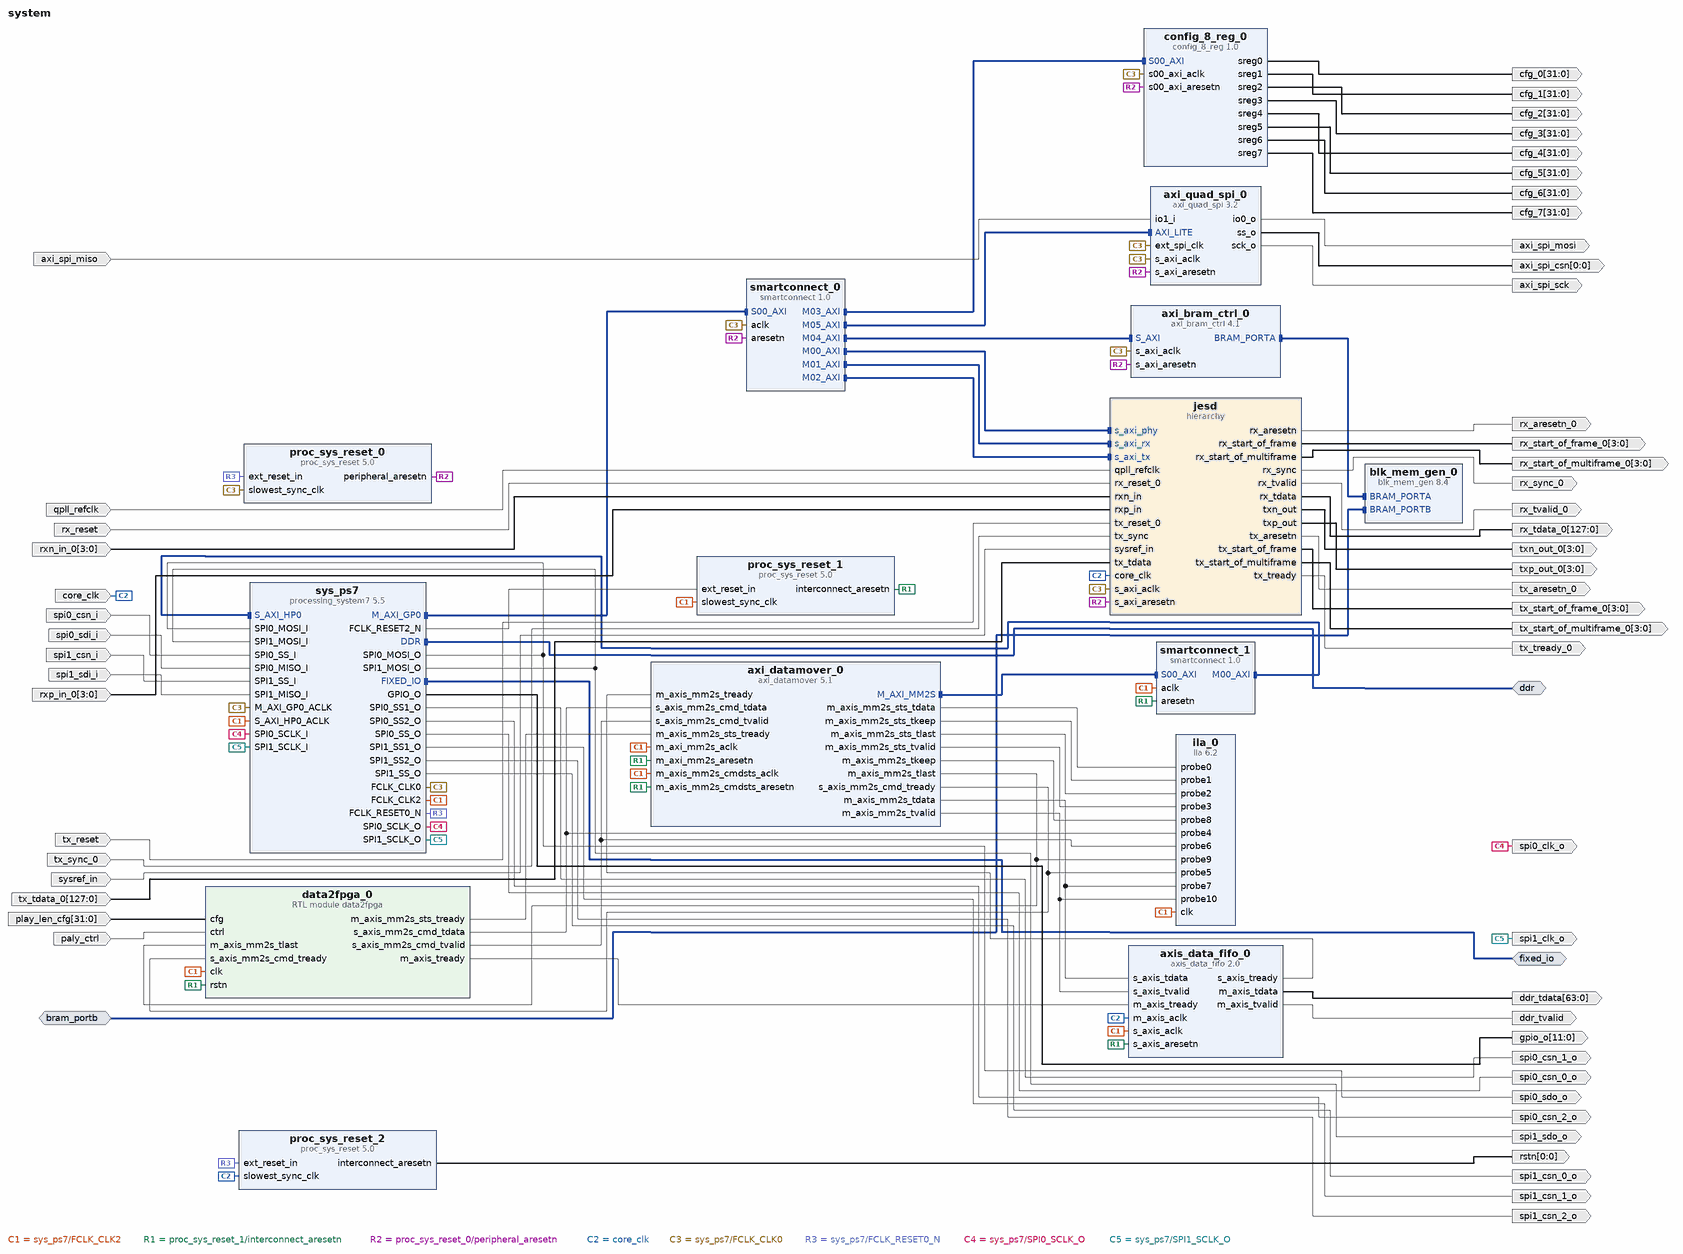
[diagram p0: block diagram of the top level]
# Vivado block design system, xc7z045ffg900-2, Vivado 2022.2
create_bd_design system

create_bd_intf_port -mode Master -vlnv xilinx.com:interface:ddrx_rtl:1.0 ddr
create_bd_intf_port -mode Master -vlnv xilinx.com:display_processing_system7:fixedio_rtl:1.0 fixed_io
create_bd_intf_port -mode Slave -vlnv xilinx.com:interface:bram_rtl:1.0 bram_portb
set_property -dict {CONFIG.MASTER_TYPE BRAM_CTRL CONFIG.READ_WRITE_MODE READ_WRITE} [get_bd_intf_ports bram_portb]
create_bd_port -dir O spi0_clk_o
create_bd_port -dir O spi0_csn_0_o
create_bd_port -dir O spi0_csn_1_o
create_bd_port -dir O spi0_csn_2_o
create_bd_port -dir I spi0_csn_i
create_bd_port -dir I spi0_sdi_i
create_bd_port -dir O spi0_sdo_o
create_bd_port -dir O spi1_clk_o
create_bd_port -dir O spi1_csn_0_o
create_bd_port -dir O spi1_csn_1_o
create_bd_port -dir O spi1_csn_2_o
create_bd_port -dir I spi1_csn_i
create_bd_port -dir I spi1_sdi_i
create_bd_port -dir O spi1_sdo_o
create_bd_port -dir O -from 3 -to 0 txp_out_0
create_bd_port -dir O -from 3 -to 0 txn_out_0
create_bd_port -dir O rx_sync_0
create_bd_port -dir O -type rst tx_aresetn_0
create_bd_port -dir O -type rst rx_aresetn_0
create_bd_port -dir O rx_tvalid_0
create_bd_port -dir O tx_tready_0
create_bd_port -dir O -from 3 -to 0 rx_start_of_frame_0
create_bd_port -dir O -from 3 -to 0 rx_start_of_multiframe_0
create_bd_port -dir O -from 3 -to 0 tx_start_of_frame_0
create_bd_port -dir O -from 3 -to 0 tx_start_of_multiframe_0
create_bd_port -dir I tx_sync_0
create_bd_port -dir I sysref_in
create_bd_port -dir I -type clk core_clk
set_property -dict {CONFIG.ASSOCIATED_RESET rstn CONFIG.FREQ_HZ 250000000} [get_bd_ports core_clk]
create_bd_port -dir I -type clk qpll_refclk
set_property -dict {CONFIG.FREQ_HZ 250000000} [get_bd_ports qpll_refclk]
create_bd_port -dir I rx_reset
create_bd_port -dir I tx_reset
create_bd_port -dir O -from 127 -to 0 rx_tdata_0
create_bd_port -dir I -from 127 -to 0 tx_tdata_0
create_bd_port -dir I -from 3 -to 0 rxp_in_0
create_bd_port -dir I -from 3 -to 0 rxn_in_0
create_bd_port -dir O -from 11 -to 0 gpio_o
create_bd_port -dir O -from 31 -to 0 cfg_0
create_bd_port -dir O -from 31 -to 0 cfg_1
create_bd_port -dir O -from 31 -to 0 cfg_2
create_bd_port -dir O -from 31 -to 0 cfg_3
create_bd_port -dir O -from 63 -to 0 ddr_tdata
create_bd_port -dir O ddr_tvalid
create_bd_port -dir O -from 31 -to 0 cfg_4
create_bd_port -dir O -from 31 -to 0 cfg_5
create_bd_port -dir O -from 31 -to 0 cfg_6
create_bd_port -dir O -from 31 -to 0 cfg_7
create_bd_port -dir I paly_ctrl
create_bd_port -dir I -from 31 -to 0 play_len_cfg
create_bd_port -dir O -from 0 -to 0 -type rst rstn
create_bd_port -dir O axi_spi_sck
create_bd_port -dir O -from 0 -to 0 axi_spi_csn
create_bd_port -dir O axi_spi_mosi
create_bd_port -dir I axi_spi_miso

create_bd_cell -type ip -vlnv xilinx.com:ip:processing_system7:5.5 sys_ps7
set_property -dict [list \
  CONFIG.PCW_APU_PERIPHERAL_FREQMHZ 667.000000 \
  CONFIG.PCW_DUAL_PARALLEL_QSPI_DATA_MODE x8 \
  CONFIG.PCW_ENET0_ENET0_IO {MIO 16 .. 27} \
  CONFIG.PCW_ENET0_GRP_MDIO_ENABLE 1 \
  CONFIG.PCW_ENET0_GRP_MDIO_IO {MIO 52 .. 53} \
  CONFIG.PCW_ENET0_PERIPHERAL_ENABLE 1 \
  CONFIG.PCW_ENET0_RESET_ENABLE 0 \
  CONFIG.PCW_ENET_RESET_ENABLE 1 \
  CONFIG.PCW_ENET_RESET_SELECT {Share reset pin} \
  CONFIG.PCW_EN_CLK2_PORT 1 \
  CONFIG.PCW_EN_RST2_PORT 1 \
  CONFIG.PCW_FCLK2_PERIPHERAL_CLKSRC {DDR PLL} \
  CONFIG.PCW_FCLK_CLK2_BUF TRUE \
  CONFIG.PCW_FPGA0_PERIPHERAL_FREQMHZ 100.0 \
  CONFIG.PCW_FPGA1_PERIPHERAL_FREQMHZ 200.0 \
  CONFIG.PCW_FPGA2_PERIPHERAL_FREQMHZ 250 \
  CONFIG.PCW_FPGA_FCLK2_ENABLE 1 \
  CONFIG.PCW_GPIO_EMIO_GPIO_ENABLE 1 \
  CONFIG.PCW_GPIO_EMIO_GPIO_IO 12 \
  CONFIG.PCW_GPIO_EMIO_GPIO_WIDTH 12 \
  CONFIG.PCW_GPIO_MIO_GPIO_ENABLE 1 \
  CONFIG.PCW_GPIO_MIO_GPIO_IO MIO \
  CONFIG.PCW_I2C_RESET_ENABLE 0 \
  CONFIG.PCW_IRQ_F2P_MODE REVERSE \
  CONFIG.PCW_PRESET_BANK0_VOLTAGE {LVCMOS 1.8V} \
  CONFIG.PCW_PRESET_BANK1_VOLTAGE {LVCMOS 1.8V} \
  CONFIG.PCW_QSPI_GRP_FBCLK_ENABLE 1 \
  CONFIG.PCW_QSPI_GRP_FBCLK_IO {MIO 8} \
  CONFIG.PCW_QSPI_GRP_IO1_ENABLE 1 \
  CONFIG.PCW_QSPI_GRP_IO1_IO {MIO 0 9 .. 13} \
  CONFIG.PCW_QSPI_GRP_SINGLE_SS_ENABLE 0 \
  CONFIG.PCW_QSPI_INTERNAL_HIGHADDRESS 0xFDFFFFFF \
  CONFIG.PCW_QSPI_PERIPHERAL_ENABLE 1 \
  CONFIG.PCW_QSPI_QSPI_IO {MIO 1 .. 6} \
  CONFIG.PCW_SD0_GRP_CD_ENABLE 1 \
  CONFIG.PCW_SD0_GRP_CD_IO {MIO 14} \
  CONFIG.PCW_SD0_GRP_WP_ENABLE 1 \
  CONFIG.PCW_SD0_GRP_WP_IO {MIO 15} \
  CONFIG.PCW_SD0_PERIPHERAL_ENABLE 1 \
  CONFIG.PCW_SD0_SD0_IO {MIO 40 .. 45} \
  CONFIG.PCW_SDIO_PERIPHERAL_FREQMHZ 100 \
  CONFIG.PCW_SPI0_PERIPHERAL_ENABLE 1 \
  CONFIG.PCW_SPI0_SPI0_IO EMIO \
  CONFIG.PCW_SPI1_PERIPHERAL_ENABLE 1 \
  CONFIG.PCW_SPI1_SPI1_IO EMIO \
  CONFIG.PCW_UART1_PERIPHERAL_ENABLE 1 \
  CONFIG.PCW_UART1_UART1_IO {MIO 48 .. 49} \
  CONFIG.PCW_UART_PERIPHERAL_FREQMHZ 50 \
  CONFIG.PCW_UIPARAM_DDR_FREQ_MHZ 533.333313 \
  CONFIG.PCW_UIPARAM_DDR_PARTNO Custom \
  CONFIG.PCW_USB0_PERIPHERAL_ENABLE 0 \
  CONFIG.PCW_USB_RESET_ENABLE 0 \
  CONFIG.PCW_USE_S_AXI_HP0 1 \
  CONFIG.preset ZC706 \
] [get_bd_cells sys_ps7]
# 260 more settings of sys_ps7 are not shown: defaults, MIO pin electricals, DDR timing, and values the tool derives
create_bd_cell -type hier jesd
create_bd_cell -type ip -vlnv xilinx.com:ip:proc_sys_reset:5.0 proc_sys_reset_0
create_bd_cell -type ip -vlnv xilinx.com:ip:proc_sys_reset:5.0 proc_sys_reset_1
create_bd_cell -type ip -vlnv xilinx.com:ip:proc_sys_reset:5.0 proc_sys_reset_2
create_bd_cell -type module -reference data2fpga data2fpga_0
create_bd_cell -type ip -vlnv xilinx.com:user:config_8_reg:1.0 config_8_reg_0
create_bd_cell -type ip -vlnv xilinx.com:ip:axi_bram_ctrl:4.1 axi_bram_ctrl_0
set_property -dict {CONFIG.DATA_WIDTH 128 CONFIG.SINGLE_PORT_BRAM 1} [get_bd_cells axi_bram_ctrl_0]
create_bd_cell -type ip -vlnv xilinx.com:ip:axi_datamover:5.1 axi_datamover_0
set_property -dict [list \
  CONFIG.c_dummy 1 \
  CONFIG.c_enable_cache_user false \
  CONFIG.c_enable_mm2s_adv_sig 0 \
  CONFIG.c_enable_s2mm 0 \
  CONFIG.c_m_axi_mm2s_data_width 128 \
  CONFIG.c_m_axis_mm2s_tdata_width 64 \
  CONFIG.c_mm2s_btt_used 23 \
  CONFIG.c_mm2s_burst_size 16 \
] [get_bd_cells axi_datamover_0]
create_bd_cell -type ip -vlnv xilinx.com:ip:axi_quad_spi:3.2 axi_quad_spi_0
set_property -dict {CONFIG.C_SCK_RATIO 8 CONFIG.C_USE_STARTUP 0} [get_bd_cells axi_quad_spi_0]
create_bd_cell -type ip -vlnv xilinx.com:ip:axis_data_fifo:2.0 axis_data_fifo_0
set_property -dict {CONFIG.IS_ACLK_ASYNC 1 CONFIG.TDATA_NUM_BYTES 8} [get_bd_cells axis_data_fifo_0]
create_bd_cell -type ip -vlnv xilinx.com:ip:blk_mem_gen:8.4 blk_mem_gen_0
set_property -dict [list \
  CONFIG.EN_SAFETY_CKT false \
  CONFIG.Enable_32bit_Address true \
  CONFIG.Enable_B Use_ENB_Pin \
  CONFIG.Memory_Type True_Dual_Port_RAM \
  CONFIG.Port_B_Clock 100 \
  CONFIG.Port_B_Enable_Rate 100 \
  CONFIG.Port_B_Write_Rate 50 \
  CONFIG.Read_Width_A 128 \
  CONFIG.Read_Width_B 128 \
  CONFIG.Register_PortA_Output_of_Memory_Primitives false \
  CONFIG.Register_PortB_Output_of_Memory_Primitives false \
  CONFIG.Use_RSTA_Pin true \
  CONFIG.Use_RSTB_Pin true \
  CONFIG.Write_Width_A 128 \
  CONFIG.Write_Width_B 128 \
  CONFIG.use_bram_block BRAM_Controller \
] [get_bd_cells blk_mem_gen_0]
create_bd_cell -type ip -vlnv xilinx.com:ip:ila:6.2 ila_0
set_property -dict [list \
  CONFIG.C_DATA_DEPTH 8192 \
  CONFIG.C_ENABLE_ILA_AXI_MON false \
  CONFIG.C_MONITOR_TYPE Native \
  CONFIG.C_NUM_OF_PROBES 11 \
  CONFIG.C_PROBE0_WIDTH 8 \
  CONFIG.C_PROBE4_WIDTH 72 \
  CONFIG.C_PROBE7_WIDTH 64 \
] [get_bd_cells ila_0]
create_bd_cell -type ip -vlnv xilinx.com:ip:smartconnect:1.0 smartconnect_0
set_property -dict {CONFIG.NUM_MI 6 CONFIG.NUM_SI 1} [get_bd_cells smartconnect_0]
create_bd_cell -type ip -vlnv xilinx.com:ip:smartconnect:1.0 smartconnect_1
set_property -dict {CONFIG.NUM_SI 1} [get_bd_cells smartconnect_1]

# ---- hierarchy /jesd ----
current_bd_instance /jesd
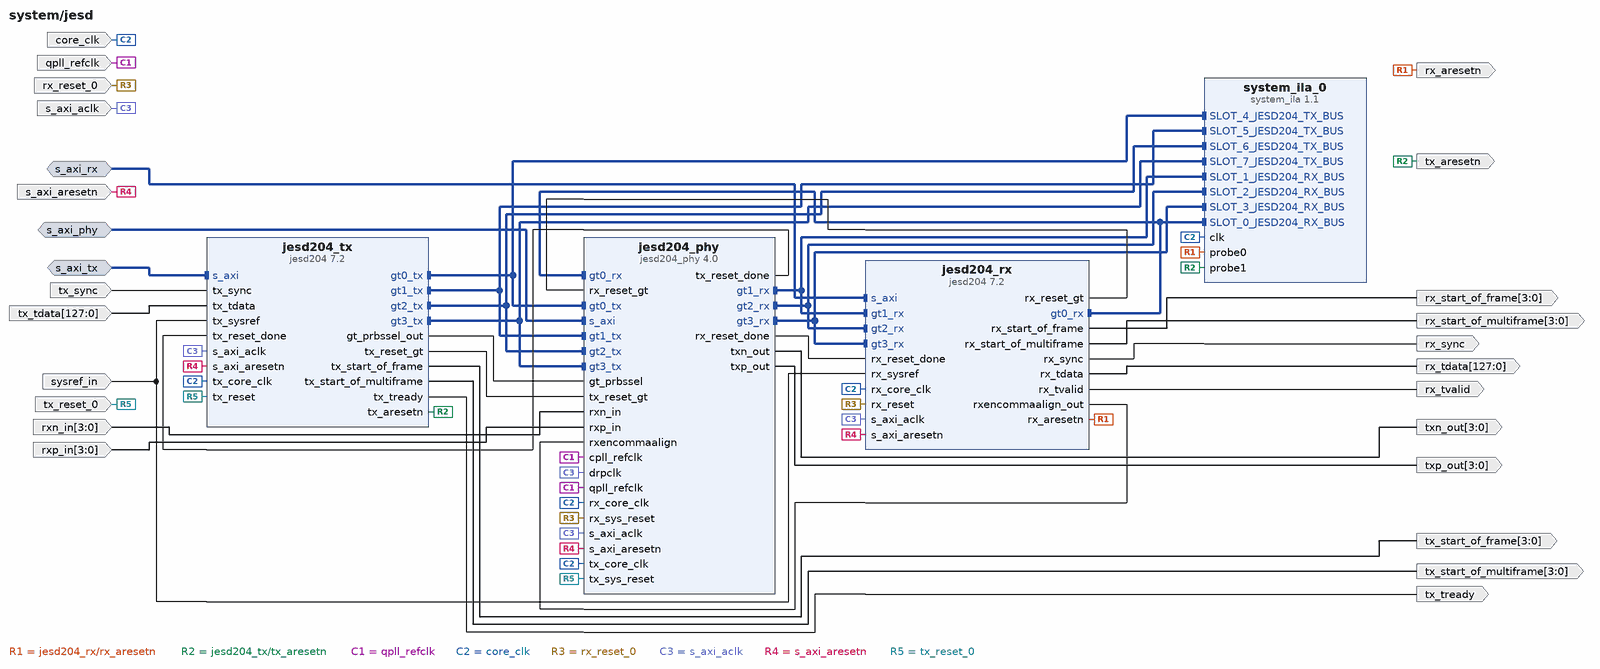
[diagram p1: block diagram inside /jesd]
create_bd_intf_pin -mode Slave -vlnv xilinx.com:interface:aximm_rtl:1.0 s_axi_phy
create_bd_intf_pin -mode Slave -vlnv xilinx.com:interface:aximm_rtl:1.0 s_axi_rx
create_bd_intf_pin -mode Slave -vlnv xilinx.com:interface:aximm_rtl:1.0 s_axi_tx
create_bd_pin -dir I -type clk qpll_refclk
create_bd_pin -dir I -type clk s_axi_aclk
create_bd_pin -dir I tx_reset_0
create_bd_pin -dir O -from 3 -to 0 txp_out
create_bd_pin -dir O -from 3 -to 0 txn_out
create_bd_pin -dir I -type clk core_clk
create_bd_pin -dir I -type rst s_axi_aresetn
create_bd_pin -dir O -type rst rx_aresetn
create_bd_pin -dir O rx_tvalid
create_bd_pin -dir O -from 3 -to 0 rx_start_of_frame
create_bd_pin -dir O -from 3 -to 0 rx_start_of_multiframe
create_bd_pin -dir I sysref_in
create_bd_pin -dir O rx_sync
create_bd_pin -dir O -from 3 -to 0 tx_start_of_frame
create_bd_pin -dir O -from 3 -to 0 tx_start_of_multiframe
create_bd_pin -dir O -type rst tx_aresetn
create_bd_pin -dir O tx_tready
create_bd_pin -dir I tx_sync
create_bd_pin -dir I rx_reset_0
create_bd_pin -dir O -from 127 -to 0 rx_tdata
create_bd_pin -dir I -from 127 -to 0 tx_tdata
create_bd_pin -dir I -from 3 -to 0 rxp_in
create_bd_pin -dir I -from 3 -to 0 rxn_in

create_bd_cell -type ip -vlnv xilinx.com:ip:jesd204:7.2 jesd204_rx
set_property -dict [list \
  CONFIG.C_DEFAULT_F 4 \
  CONFIG.C_DEFAULT_SCR 1 \
  CONFIG.C_LANES 4 \
  CONFIG.C_NODE_IS_TRANSMIT 0 \
] [get_bd_cells jesd204_rx]
create_bd_cell -type ip -vlnv xilinx.com:ip:jesd204:7.2 jesd204_tx
set_property -dict {CONFIG.C_DEFAULT_F 4 CONFIG.C_DEFAULT_SCR 1 CONFIG.C_LANES 4} [get_bd_cells jesd204_tx]
create_bd_cell -type ip -vlnv xilinx.com:ip:jesd204_phy:4.0 jesd204_phy
set_property -dict [list \
  CONFIG.C_LANES 4 \
  CONFIG.C_PLL_SELECTION 3 \
  CONFIG.Config_Type 1 \
  CONFIG.GT_Line_Rate 9.8304 \
  CONFIG.GT_REFCLK_FREQ 245.760 \
  CONFIG.Max_Line_Rate 10 \
  CONFIG.Min_Line_Rate 6 \
  CONFIG.RX_GT_Line_Rate 9.8304 \
  CONFIG.RX_GT_REFCLK_FREQ 245.760 \
  CONFIG.RX_PLL_SELECTION 3 \
] [get_bd_cells jesd204_phy]
create_bd_cell -type ip -vlnv xilinx.com:ip:system_ila:1.1 system_ila_0
set_property -dict [list \
  CONFIG.C_MON_TYPE MIX \
  CONFIG.C_NUM_MONITOR_SLOTS 8 \
  CONFIG.C_NUM_OF_PROBES 2 \
  CONFIG.C_SLOT 7 \
  CONFIG.C_SLOT_0_INTF_TYPE xilinx.com:display_jesd204:jesd204_rx_bus_rtl:1.0 \
  CONFIG.C_SLOT_1_INTF_TYPE xilinx.com:display_jesd204:jesd204_rx_bus_rtl:1.0 \
  CONFIG.C_SLOT_2_INTF_TYPE xilinx.com:display_jesd204:jesd204_rx_bus_rtl:1.0 \
  CONFIG.C_SLOT_3_INTF_TYPE xilinx.com:display_jesd204:jesd204_rx_bus_rtl:1.0 \
  CONFIG.C_SLOT_4_INTF_TYPE xilinx.com:display_jesd204:jesd204_tx_bus_rtl:1.0 \
  CONFIG.C_SLOT_5_INTF_TYPE xilinx.com:display_jesd204:jesd204_tx_bus_rtl:1.0 \
  CONFIG.C_SLOT_6_INTF_TYPE xilinx.com:display_jesd204:jesd204_tx_bus_rtl:1.0 \
  CONFIG.C_SLOT_7_INTF_TYPE xilinx.com:display_jesd204:jesd204_tx_bus_rtl:1.0 \
] [get_bd_cells system_ila_0]

# ---- connections ----

current_bd_instance /jesd
connect_bd_intf_net [get_bd_intf_pins jesd204_rx/gt0_rx] [get_bd_intf_pins jesd204_phy/gt0_rx]
connect_bd_intf_net [get_bd_intf_pins jesd204_rx/gt0_rx] [get_bd_intf_pins system_ila_0/SLOT_0_JESD204_RX_BUS]
connect_bd_intf_net [get_bd_intf_pins jesd204_phy/gt1_rx] [get_bd_intf_pins jesd204_rx/gt1_rx]
connect_bd_intf_net [get_bd_intf_pins jesd204_phy/gt1_rx] [get_bd_intf_pins system_ila_0/SLOT_1_JESD204_RX_BUS]
connect_bd_intf_net [get_bd_intf_pins jesd204_phy/gt2_rx] [get_bd_intf_pins jesd204_rx/gt2_rx]
connect_bd_intf_net [get_bd_intf_pins jesd204_phy/gt2_rx] [get_bd_intf_pins system_ila_0/SLOT_2_JESD204_RX_BUS]
connect_bd_intf_net [get_bd_intf_pins jesd204_phy/gt3_rx] [get_bd_intf_pins jesd204_rx/gt3_rx]
connect_bd_intf_net [get_bd_intf_pins jesd204_phy/gt3_rx] [get_bd_intf_pins system_ila_0/SLOT_3_JESD204_RX_BUS]
connect_bd_intf_net [get_bd_intf_pins jesd204_tx/gt0_tx] [get_bd_intf_pins jesd204_phy/gt0_tx]
connect_bd_intf_net [get_bd_intf_pins jesd204_tx/gt0_tx] [get_bd_intf_pins system_ila_0/SLOT_4_JESD204_TX_BUS]
connect_bd_intf_net [get_bd_intf_pins jesd204_tx/gt1_tx] [get_bd_intf_pins jesd204_phy/gt1_tx]
connect_bd_intf_net [get_bd_intf_pins jesd204_tx/gt1_tx] [get_bd_intf_pins system_ila_0/SLOT_5_JESD204_TX_BUS]
connect_bd_intf_net [get_bd_intf_pins jesd204_tx/gt2_tx] [get_bd_intf_pins jesd204_phy/gt2_tx]
connect_bd_intf_net [get_bd_intf_pins jesd204_tx/gt2_tx] [get_bd_intf_pins system_ila_0/SLOT_6_JESD204_TX_BUS]
connect_bd_intf_net [get_bd_intf_pins jesd204_tx/gt3_tx] [get_bd_intf_pins jesd204_phy/gt3_tx]
connect_bd_intf_net [get_bd_intf_pins jesd204_tx/gt3_tx] [get_bd_intf_pins system_ila_0/SLOT_7_JESD204_TX_BUS]
connect_bd_intf_net -intf_net s_axi_0_1 [get_bd_intf_pins s_axi_phy] [get_bd_intf_pins jesd204_phy/s_axi]
connect_bd_intf_net -intf_net s_axi_0_2 [get_bd_intf_pins s_axi_tx] [get_bd_intf_pins jesd204_tx/s_axi]
connect_bd_intf_net -intf_net s_axi_0_3 [get_bd_intf_pins s_axi_rx] [get_bd_intf_pins jesd204_rx/s_axi]
connect_bd_net [get_bd_pins jesd204_phy/rx_reset_done] [get_bd_pins jesd204_rx/rx_reset_done]
connect_bd_net [get_bd_pins jesd204_phy/tx_reset_done] [get_bd_pins jesd204_tx/tx_reset_done]
connect_bd_net [get_bd_pins jesd204_phy/txn_out] [get_bd_pins txn_out]
connect_bd_net [get_bd_pins jesd204_phy/txp_out] [get_bd_pins txp_out]
connect_bd_net [get_bd_pins jesd204_rx/rx_aresetn] [get_bd_pins rx_aresetn] [get_bd_pins system_ila_0/probe0]
connect_bd_net [get_bd_pins jesd204_rx/rx_reset_gt] [get_bd_pins jesd204_phy/rx_reset_gt]
connect_bd_net [get_bd_pins jesd204_rx/rx_start_of_frame] [get_bd_pins rx_start_of_frame]
connect_bd_net [get_bd_pins jesd204_rx/rx_start_of_multiframe] [get_bd_pins rx_start_of_multiframe]
connect_bd_net [get_bd_pins jesd204_rx/rx_sync] [get_bd_pins rx_sync]
connect_bd_net [get_bd_pins jesd204_rx/rx_tdata] [get_bd_pins rx_tdata]
connect_bd_net [get_bd_pins jesd204_rx/rx_tvalid] [get_bd_pins rx_tvalid]
connect_bd_net [get_bd_pins jesd204_rx/rxencommaalign_out] [get_bd_pins jesd204_phy/rxencommaalign]
connect_bd_net [get_bd_pins jesd204_tx/gt_prbssel_out] [get_bd_pins jesd204_phy/gt_prbssel]
connect_bd_net [get_bd_pins jesd204_tx/tx_aresetn] [get_bd_pins tx_aresetn] [get_bd_pins system_ila_0/probe1]
connect_bd_net [get_bd_pins jesd204_tx/tx_reset_gt] [get_bd_pins jesd204_phy/tx_reset_gt]
connect_bd_net [get_bd_pins jesd204_tx/tx_start_of_frame] [get_bd_pins tx_start_of_frame]
connect_bd_net [get_bd_pins jesd204_tx/tx_start_of_multiframe] [get_bd_pins tx_start_of_multiframe]
connect_bd_net [get_bd_pins jesd204_tx/tx_tready] [get_bd_pins tx_tready]
connect_bd_net -net qpll_refclk_0_1 [get_bd_pins qpll_refclk] [get_bd_pins jesd204_phy/cpll_refclk] [get_bd_pins jesd204_phy/qpll_refclk]
connect_bd_net -net rx_core_clk_0_1 [get_bd_pins core_clk] \
  [get_bd_pins jesd204_rx/rx_core_clk] [get_bd_pins jesd204_tx/tx_core_clk] [get_bd_pins jesd204_phy/tx_core_clk] \
  [get_bd_pins jesd204_phy/rx_core_clk] [get_bd_pins system_ila_0/clk]
connect_bd_net [get_bd_pins rx_reset_0] [get_bd_pins jesd204_rx/rx_reset] [get_bd_pins jesd204_phy/rx_sys_reset]
connect_bd_net -net rxn_in_0_1 [get_bd_pins rxn_in] [get_bd_pins jesd204_phy/rxn_in]
connect_bd_net -net rxp_in_0_1 [get_bd_pins rxp_in] [get_bd_pins jesd204_phy/rxp_in]
connect_bd_net -net s_axi_aclk_0_1 [get_bd_pins s_axi_aclk] \
  [get_bd_pins jesd204_rx/s_axi_aclk] [get_bd_pins jesd204_tx/s_axi_aclk] [get_bd_pins jesd204_phy/drpclk] \
  [get_bd_pins jesd204_phy/s_axi_aclk]
connect_bd_net -net s_axi_aresetn_0_1 [get_bd_pins s_axi_aresetn] \
  [get_bd_pins jesd204_rx/s_axi_aresetn] [get_bd_pins jesd204_tx/s_axi_aresetn] [get_bd_pins jesd204_phy/s_axi_aresetn]
connect_bd_net -net tx_reset_0_1 [get_bd_pins tx_reset_0] [get_bd_pins jesd204_tx/tx_reset] [get_bd_pins jesd204_phy/tx_sys_reset]
connect_bd_net -net tx_sync_0_1 [get_bd_pins tx_sync] [get_bd_pins jesd204_tx/tx_sync]
connect_bd_net -net tx_sysref_0_1 [get_bd_pins sysref_in] [get_bd_pins jesd204_rx/rx_sysref] [get_bd_pins jesd204_tx/tx_sysref]
connect_bd_net -net tx_tdata_1_1 [get_bd_pins tx_tdata] [get_bd_pins jesd204_tx/tx_tdata]

current_bd_instance /
connect_bd_intf_net -intf_net BRAM_PORTB_0_1 [get_bd_intf_ports bram_portb] [get_bd_intf_pins blk_mem_gen_0/BRAM_PORTB]
connect_bd_intf_net [get_bd_intf_pins blk_mem_gen_0/BRAM_PORTA] [get_bd_intf_pins axi_bram_ctrl_0/BRAM_PORTA]
connect_bd_intf_net [get_bd_intf_pins smartconnect_1/S00_AXI] [get_bd_intf_pins axi_datamover_0/M_AXI_MM2S]
connect_bd_intf_net [get_bd_intf_pins smartconnect_0/M00_AXI] [get_bd_intf_pins jesd/s_axi_phy]
connect_bd_intf_net [get_bd_intf_pins smartconnect_0/M01_AXI] [get_bd_intf_pins jesd/s_axi_rx]
connect_bd_intf_net [get_bd_intf_pins smartconnect_0/M02_AXI] [get_bd_intf_pins jesd/s_axi_tx]
connect_bd_intf_net [get_bd_intf_pins config_8_reg_0/S00_AXI] [get_bd_intf_pins smartconnect_0/M03_AXI]
connect_bd_intf_net [get_bd_intf_pins axi_bram_ctrl_0/S_AXI] [get_bd_intf_pins smartconnect_0/M04_AXI]
connect_bd_intf_net [get_bd_intf_pins smartconnect_0/M05_AXI] [get_bd_intf_pins axi_quad_spi_0/AXI_LITE]
connect_bd_intf_net [get_bd_intf_pins smartconnect_1/M00_AXI] [get_bd_intf_pins sys_ps7/S_AXI_HP0]
connect_bd_intf_net [get_bd_intf_ports ddr] [get_bd_intf_pins sys_ps7/DDR]
connect_bd_intf_net [get_bd_intf_ports fixed_io] [get_bd_intf_pins sys_ps7/FIXED_IO]
connect_bd_intf_net [get_bd_intf_pins sys_ps7/M_AXI_GP0] [get_bd_intf_pins smartconnect_0/S00_AXI]
connect_bd_net [get_bd_pins sys_ps7/FCLK_CLK2] \
  [get_bd_pins sys_ps7/S_AXI_HP0_ACLK] [get_bd_pins proc_sys_reset_1/slowest_sync_clk] [get_bd_pins data2fpga_0/clk] \
  [get_bd_pins axi_datamover_0/m_axi_mm2s_aclk] [get_bd_pins axi_datamover_0/m_axis_mm2s_cmdsts_aclk] \
  [get_bd_pins axis_data_fifo_0/s_axis_aclk] [get_bd_pins ila_0/clk] [get_bd_pins smartconnect_1/aclk]
connect_bd_net [get_bd_pins proc_sys_reset_1/interconnect_aresetn] \
  [get_bd_pins data2fpga_0/rstn] [get_bd_pins axi_datamover_0/m_axi_mm2s_aresetn] \
  [get_bd_pins axi_datamover_0/m_axis_mm2s_cmdsts_aresetn] [get_bd_pins axis_data_fifo_0/s_axis_aresetn] \
  [get_bd_pins smartconnect_1/aresetn]
connect_bd_net [get_bd_pins axi_datamover_0/m_axis_mm2s_sts_tdata] [get_bd_pins ila_0/probe0]
connect_bd_net [get_bd_pins axi_datamover_0/m_axis_mm2s_sts_tkeep] [get_bd_pins ila_0/probe1]
connect_bd_net [get_bd_pins axi_datamover_0/m_axis_mm2s_sts_tlast] [get_bd_pins ila_0/probe2]
connect_bd_net [get_bd_pins axi_datamover_0/m_axis_mm2s_sts_tvalid] [get_bd_pins ila_0/probe3]
connect_bd_net [get_bd_pins axi_datamover_0/m_axis_mm2s_tdata] [get_bd_pins axis_data_fifo_0/s_axis_tdata] [get_bd_pins ila_0/probe7]
connect_bd_net [get_bd_pins axi_datamover_0/m_axis_mm2s_tkeep] [get_bd_pins ila_0/probe8]
connect_bd_net [get_bd_pins axi_datamover_0/m_axis_mm2s_tlast] [get_bd_pins data2fpga_0/m_axis_mm2s_tlast] [get_bd_pins ila_0/probe9]
connect_bd_net [get_bd_pins axi_datamover_0/m_axis_mm2s_tvalid] [get_bd_pins axis_data_fifo_0/s_axis_tvalid] [get_bd_pins ila_0/probe10]
connect_bd_net [get_bd_pins axi_datamover_0/s_axis_mm2s_cmd_tready] [get_bd_pins data2fpga_0/s_axis_mm2s_cmd_tready] [get_bd_pins ila_0/probe5]
connect_bd_net [get_bd_pins axi_quad_spi_0/io0_o] [get_bd_ports axi_spi_mosi]
connect_bd_net [get_bd_pins axi_quad_spi_0/sck_o] [get_bd_ports axi_spi_sck]
connect_bd_net [get_bd_pins axi_quad_spi_0/ss_o] [get_bd_ports axi_spi_csn]
connect_bd_net [get_bd_pins axis_data_fifo_0/m_axis_tdata] [get_bd_ports ddr_tdata]
connect_bd_net [get_bd_pins axis_data_fifo_0/m_axis_tvalid] [get_bd_ports ddr_tvalid]
connect_bd_net [get_bd_pins axis_data_fifo_0/s_axis_tready] [get_bd_pins axi_datamover_0/m_axis_mm2s_tready]
connect_bd_net -net cfg_8_1 [get_bd_ports play_len_cfg] [get_bd_pins data2fpga_0/cfg]
connect_bd_net [get_bd_pins config_8_reg_0/sreg0] [get_bd_ports cfg_0]
connect_bd_net [get_bd_pins config_8_reg_0/sreg1] [get_bd_ports cfg_1]
connect_bd_net [get_bd_pins config_8_reg_0/sreg2] [get_bd_ports cfg_2]
connect_bd_net [get_bd_pins config_8_reg_0/sreg3] [get_bd_ports cfg_3]
connect_bd_net [get_bd_pins config_8_reg_0/sreg4] [get_bd_ports cfg_4]
connect_bd_net [get_bd_pins config_8_reg_0/sreg5] [get_bd_ports cfg_5]
connect_bd_net [get_bd_pins config_8_reg_0/sreg6] [get_bd_ports cfg_6]
connect_bd_net [get_bd_pins config_8_reg_0/sreg7] [get_bd_ports cfg_7]
connect_bd_net -net ctrl_0_1 [get_bd_ports paly_ctrl] [get_bd_pins data2fpga_0/ctrl]
connect_bd_net [get_bd_pins data2fpga_0/m_axis_mm2s_sts_tready] [get_bd_pins axi_datamover_0/m_axis_mm2s_sts_tready]
connect_bd_net [get_bd_pins data2fpga_0/m_axis_tready] [get_bd_pins axis_data_fifo_0/m_axis_tready]
connect_bd_net [get_bd_pins data2fpga_0/s_axis_mm2s_cmd_tdata] [get_bd_pins axi_datamover_0/s_axis_mm2s_cmd_tdata] [get_bd_pins ila_0/probe4]
connect_bd_net [get_bd_pins data2fpga_0/s_axis_mm2s_cmd_tvalid] [get_bd_pins axi_datamover_0/s_axis_mm2s_cmd_tvalid] [get_bd_pins ila_0/probe6]
connect_bd_net -net io1_i_0_1 [get_bd_ports axi_spi_miso] [get_bd_pins axi_quad_spi_0/io1_i]
connect_bd_net -net jesd204_phy_txn_out [get_bd_pins jesd/txn_out] [get_bd_ports txn_out_0]
connect_bd_net -net jesd204_phy_txp_out [get_bd_pins jesd/txp_out] [get_bd_ports txp_out_0]
connect_bd_net -net jesd204_rx_rx_aresetn [get_bd_pins jesd/rx_aresetn] [get_bd_ports rx_aresetn_0]
connect_bd_net -net jesd204_rx_rx_start_of_frame [get_bd_pins jesd/rx_start_of_frame] [get_bd_ports rx_start_of_frame_0]
connect_bd_net -net jesd204_rx_rx_start_of_multiframe [get_bd_pins jesd/rx_start_of_multiframe] [get_bd_ports rx_start_of_multiframe_0]
connect_bd_net -net jesd204_rx_rx_sync [get_bd_pins jesd/rx_sync] [get_bd_ports rx_sync_0]
connect_bd_net -net jesd204_rx_rx_tvalid [get_bd_pins jesd/rx_tvalid] [get_bd_ports rx_tvalid_0]
connect_bd_net -net jesd204_tx_tx_aresetn [get_bd_pins jesd/tx_aresetn] [get_bd_ports tx_aresetn_0]
connect_bd_net -net jesd204_tx_tx_start_of_frame [get_bd_pins jesd/tx_start_of_frame] [get_bd_ports tx_start_of_frame_0]
connect_bd_net -net jesd204_tx_tx_start_of_multiframe [get_bd_pins jesd/tx_start_of_multiframe] [get_bd_ports tx_start_of_multiframe_0]
connect_bd_net -net jesd204_tx_tx_tready [get_bd_pins jesd/tx_tready] [get_bd_ports tx_tready_0]
connect_bd_net [get_bd_pins jesd/rx_tdata] [get_bd_ports rx_tdata_0]
connect_bd_net [get_bd_pins proc_sys_reset_0/peripheral_aresetn] \
  [get_bd_pins jesd/s_axi_aresetn] [get_bd_pins config_8_reg_0/s00_axi_aresetn] [get_bd_pins axi_bram_ctrl_0/s_axi_aresetn] \
  [get_bd_pins axi_quad_spi_0/s_axi_aresetn] [get_bd_pins smartconnect_0/aresetn]
connect_bd_net [get_bd_pins proc_sys_reset_2/interconnect_aresetn] [get_bd_ports rstn]
connect_bd_net -net qpll_refclk_0_1 [get_bd_ports qpll_refclk] [get_bd_pins jesd/qpll_refclk]
connect_bd_net -net rx_core_clk_0_1 [get_bd_ports core_clk] \
  [get_bd_pins jesd/core_clk] [get_bd_pins proc_sys_reset_2/slowest_sync_clk] [get_bd_pins axis_data_fifo_0/m_axis_aclk]
connect_bd_net -net rx_reset_0_1 [get_bd_ports rx_reset] [get_bd_pins jesd/rx_reset_0]
connect_bd_net -net rxn_in_0_1 [get_bd_ports rxn_in_0] [get_bd_pins jesd/rxn_in]
connect_bd_net -net rxp_in_0_1 [get_bd_ports rxp_in_0] [get_bd_pins jesd/rxp_in]
connect_bd_net [get_bd_ports spi0_csn_i] [get_bd_pins sys_ps7/SPI0_SS_I]
connect_bd_net [get_bd_ports spi0_sdi_i] [get_bd_pins sys_ps7/SPI0_MISO_I]
connect_bd_net [get_bd_ports spi1_csn_i] [get_bd_pins sys_ps7/SPI1_SS_I]
connect_bd_net [get_bd_ports spi1_sdi_i] [get_bd_pins sys_ps7/SPI1_MISO_I]
connect_bd_net -net sys_cpu_clk [get_bd_pins sys_ps7/FCLK_CLK0] \
  [get_bd_pins sys_ps7/M_AXI_GP0_ACLK] [get_bd_pins proc_sys_reset_0/slowest_sync_clk] [get_bd_pins jesd/s_axi_aclk] \
  [get_bd_pins config_8_reg_0/s00_axi_aclk] [get_bd_pins axi_bram_ctrl_0/s_axi_aclk] [get_bd_pins axi_quad_spi_0/ext_spi_clk] \
  [get_bd_pins axi_quad_spi_0/s_axi_aclk] [get_bd_pins smartconnect_0/aclk]
connect_bd_net [get_bd_pins sys_ps7/FCLK_RESET0_N] [get_bd_pins proc_sys_reset_0/ext_reset_in] [get_bd_pins proc_sys_reset_2/ext_reset_in]
connect_bd_net [get_bd_pins sys_ps7/FCLK_RESET2_N] [get_bd_pins proc_sys_reset_1/ext_reset_in]
connect_bd_net [get_bd_pins sys_ps7/GPIO_O] [get_bd_ports gpio_o]
connect_bd_net [get_bd_pins sys_ps7/SPI0_MOSI_O] [get_bd_ports spi0_sdo_o] [get_bd_pins sys_ps7/SPI0_MOSI_I]
connect_bd_net [get_bd_pins sys_ps7/SPI0_SCLK_O] [get_bd_ports spi0_clk_o] [get_bd_pins sys_ps7/SPI0_SCLK_I]
connect_bd_net [get_bd_pins sys_ps7/SPI0_SS1_O] [get_bd_ports spi0_csn_1_o]
connect_bd_net [get_bd_pins sys_ps7/SPI0_SS2_O] [get_bd_ports spi0_csn_2_o]
connect_bd_net [get_bd_pins sys_ps7/SPI0_SS_O] [get_bd_ports spi0_csn_0_o]
connect_bd_net [get_bd_pins sys_ps7/SPI1_MOSI_O] [get_bd_ports spi1_sdo_o] [get_bd_pins sys_ps7/SPI1_MOSI_I]
connect_bd_net [get_bd_pins sys_ps7/SPI1_SCLK_O] [get_bd_ports spi1_clk_o] [get_bd_pins sys_ps7/SPI1_SCLK_I]
connect_bd_net [get_bd_pins sys_ps7/SPI1_SS1_O] [get_bd_ports spi1_csn_1_o]
connect_bd_net [get_bd_pins sys_ps7/SPI1_SS2_O] [get_bd_ports spi1_csn_2_o]
connect_bd_net [get_bd_pins sys_ps7/SPI1_SS_O] [get_bd_ports spi1_csn_0_o]
connect_bd_net -net tx_reset_0_0_1 [get_bd_ports tx_reset] [get_bd_pins jesd/tx_reset_0]
connect_bd_net -net tx_sync_0_1 [get_bd_ports tx_sync_0] [get_bd_pins jesd/tx_sync]
connect_bd_net -net tx_sysref_0_1 [get_bd_ports sysref_in] [get_bd_pins jesd/sysref_in]
connect_bd_net -net tx_tdata_0_1 [get_bd_ports tx_tdata_0] [get_bd_pins jesd/tx_tdata]
set_property HDL_ATTRIBUTE.BMM_INFO_PROCESSOR {arm > system axi_bram_ctrl_0} [get_bd_cells sys_ps7]
set_property HDL_ATTRIBUTE.KEEP_HIERARCHY yes [get_bd_cells sys_ps7]
set_property HDL_ATTRIBUTE.BMM_INFO_ADDRESS_SPACE {byte  0x40000000 128 > system blk_mem_gen_0} [get_bd_cells axi_bram_ctrl_0]
set_property HDL_ATTRIBUTE.KEEP_HIERARCHY yes [get_bd_cells axi_bram_ctrl_0]

# ---- address map ----
assign_bd_address -offset 0x00000000 -range 1G -target_address_space [get_bd_addr_spaces axi_datamover_0/Data_MM2S] [get_bd_addr_segs sys_ps7/S_AXI_HP0/HP0_DDR_LOWOCM]
assign_bd_address -offset 0x40000000 -range 256K -target_address_space [get_bd_addr_spaces sys_ps7/Data] [get_bd_addr_segs axi_bram_ctrl_0/S_AXI/Mem0]
assign_bd_address -offset 0x41E00000 -range 64K -target_address_space [get_bd_addr_spaces sys_ps7/Data] [get_bd_addr_segs axi_quad_spi_0/AXI_LITE/Reg]
assign_bd_address -offset 0x43C00000 -range 64K -target_address_space [get_bd_addr_spaces sys_ps7/Data] [get_bd_addr_segs jesd/jesd204_phy/s_axi/Reg]
assign_bd_address -offset 0x43C10000 -range 64K -target_address_space [get_bd_addr_spaces sys_ps7/Data] [get_bd_addr_segs jesd/jesd204_rx/s_axi/Reg]
assign_bd_address -offset 0x43C20000 -range 64K -target_address_space [get_bd_addr_spaces sys_ps7/Data] [get_bd_addr_segs jesd/jesd204_tx/s_axi/Reg]
assign_bd_address -offset 0x43C30000 -range 64K -target_address_space [get_bd_addr_spaces sys_ps7/Data] [get_bd_addr_segs config_8_reg_0/S00_AXI/S00_AXI_reg]

validate_bd_design
save_bd_design
